# Altium schematic sheet BK4802N_testboard.SchDoc
size A3; Organization: Turck Beierfeld GmbH; Address1: Am Bockwald 2; Address2: 08344 Grünhain-Beierfeld; Address3: Saxony; Address4: Germany; DocumentNumber: 1; SheetNumber: 1; SheetTotal: 1; ArtikelBezeichngA: Template TB; ArtikelBezeichngB: MLL4; DokuBeschreibung: Main Page; Produktionsort: TB; BearbDat: 07.05.2015; BearbName: FALB; PageSetup: Record=PageOptions|CenterHorizontal=True|CenterVertical=True|PrintScale=0.73|XCorrection=1.00|YCorrection=1.00|PrintKind=0|BorderSize=5000000|LeftOffset=0|BottomOffset=0|Orientation=2|PaperLength=1000|PaperWidth=1000|Scale=100|PaperSource=15|PrintQuality=600|MediaType=1|DitherType=10|PrintScaleMode=1|PaperKind=A4|PaperIndex=9
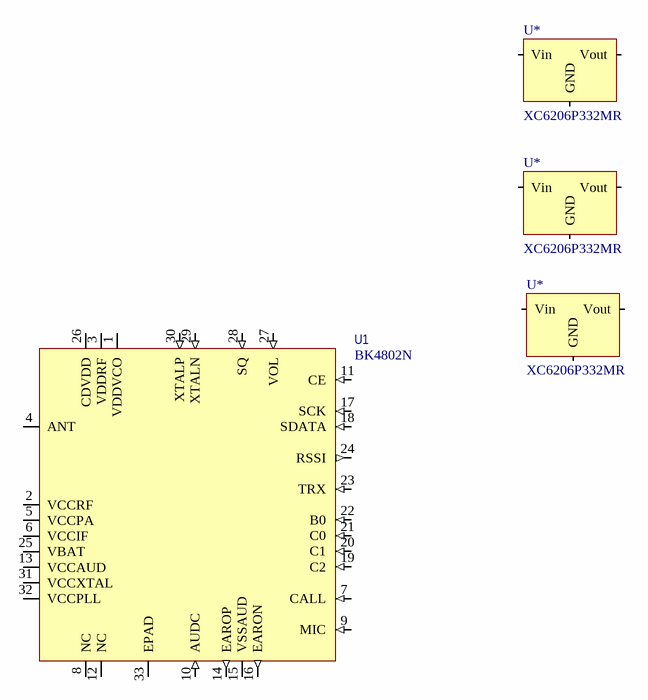
[diagram p0: BK4802N_testboard.SchDoc]

## Parts
(Parts that share a designator on the sheet are numbered #1, #2 ... from top to bottom, then left to right.)
U1  BK4802N  [QFN127P600-8N_Beken]
U*#1  XC6206P332MR  [SOT23-3 generic]
U*#2  XC6206P332MR  [SOT23-3 generic]
U*#3  XC6206P332MR  [SOT23-3 generic]

## Nets

Not connected (* = marked no-connect by the designer): U1 1(VDDVCO) 2(VCCRF) 3(VDDRF) 4(ANT) 5(VCCPA) 6(VCCIF) 7(CALL) 8(NC) 9(MIC) 10(AUDC) 11(CE) 12(NC) 13(VCCAUD) 14(EAROP) 15(VSSAUD) 16(EARON) 17(SCK) 18(SDATA) 19(C2) 20(C1) 21(C0) 22(B0) 23(TRX) 24(RSSI) 25(VBAT) 26(CDVDD) 27(VOL) 28(SQ) 29(XTALN) 30(XTALP) 31(VCCXTAL) 32(VCCPLL) 33(EPAD); U*#1 1(GND) 2(Vout) 3(Vin); U*#2 1(GND) 2(Vout) 3(Vin); U*#3 1(GND) 2(Vout) 3(Vin)

## Library data of the parts
U1 = BK4802N: Self-contained Analog FM Two Way TRX; Min Supply Voltage: 2.5V; Max Supply Voltage: 3.6V
U*#1-U*#3 = XC6206P332MR: 3.3V/0.2A Positive Fixed LDO Voltage Regulator SOT-23; Manufacturer: Torex; Output voltage: 3.3V; Maximum input voltage: 6.0V; Output current: 200mA; Dropout: 250mV; Publisher: ftg; Datasheet: https://www.torexsemi.com/file/xc6206/XC6206.pdf; Case: SOT-23-3